# EAGLE design uNav44_r1 (EAGLE 6.5.0)
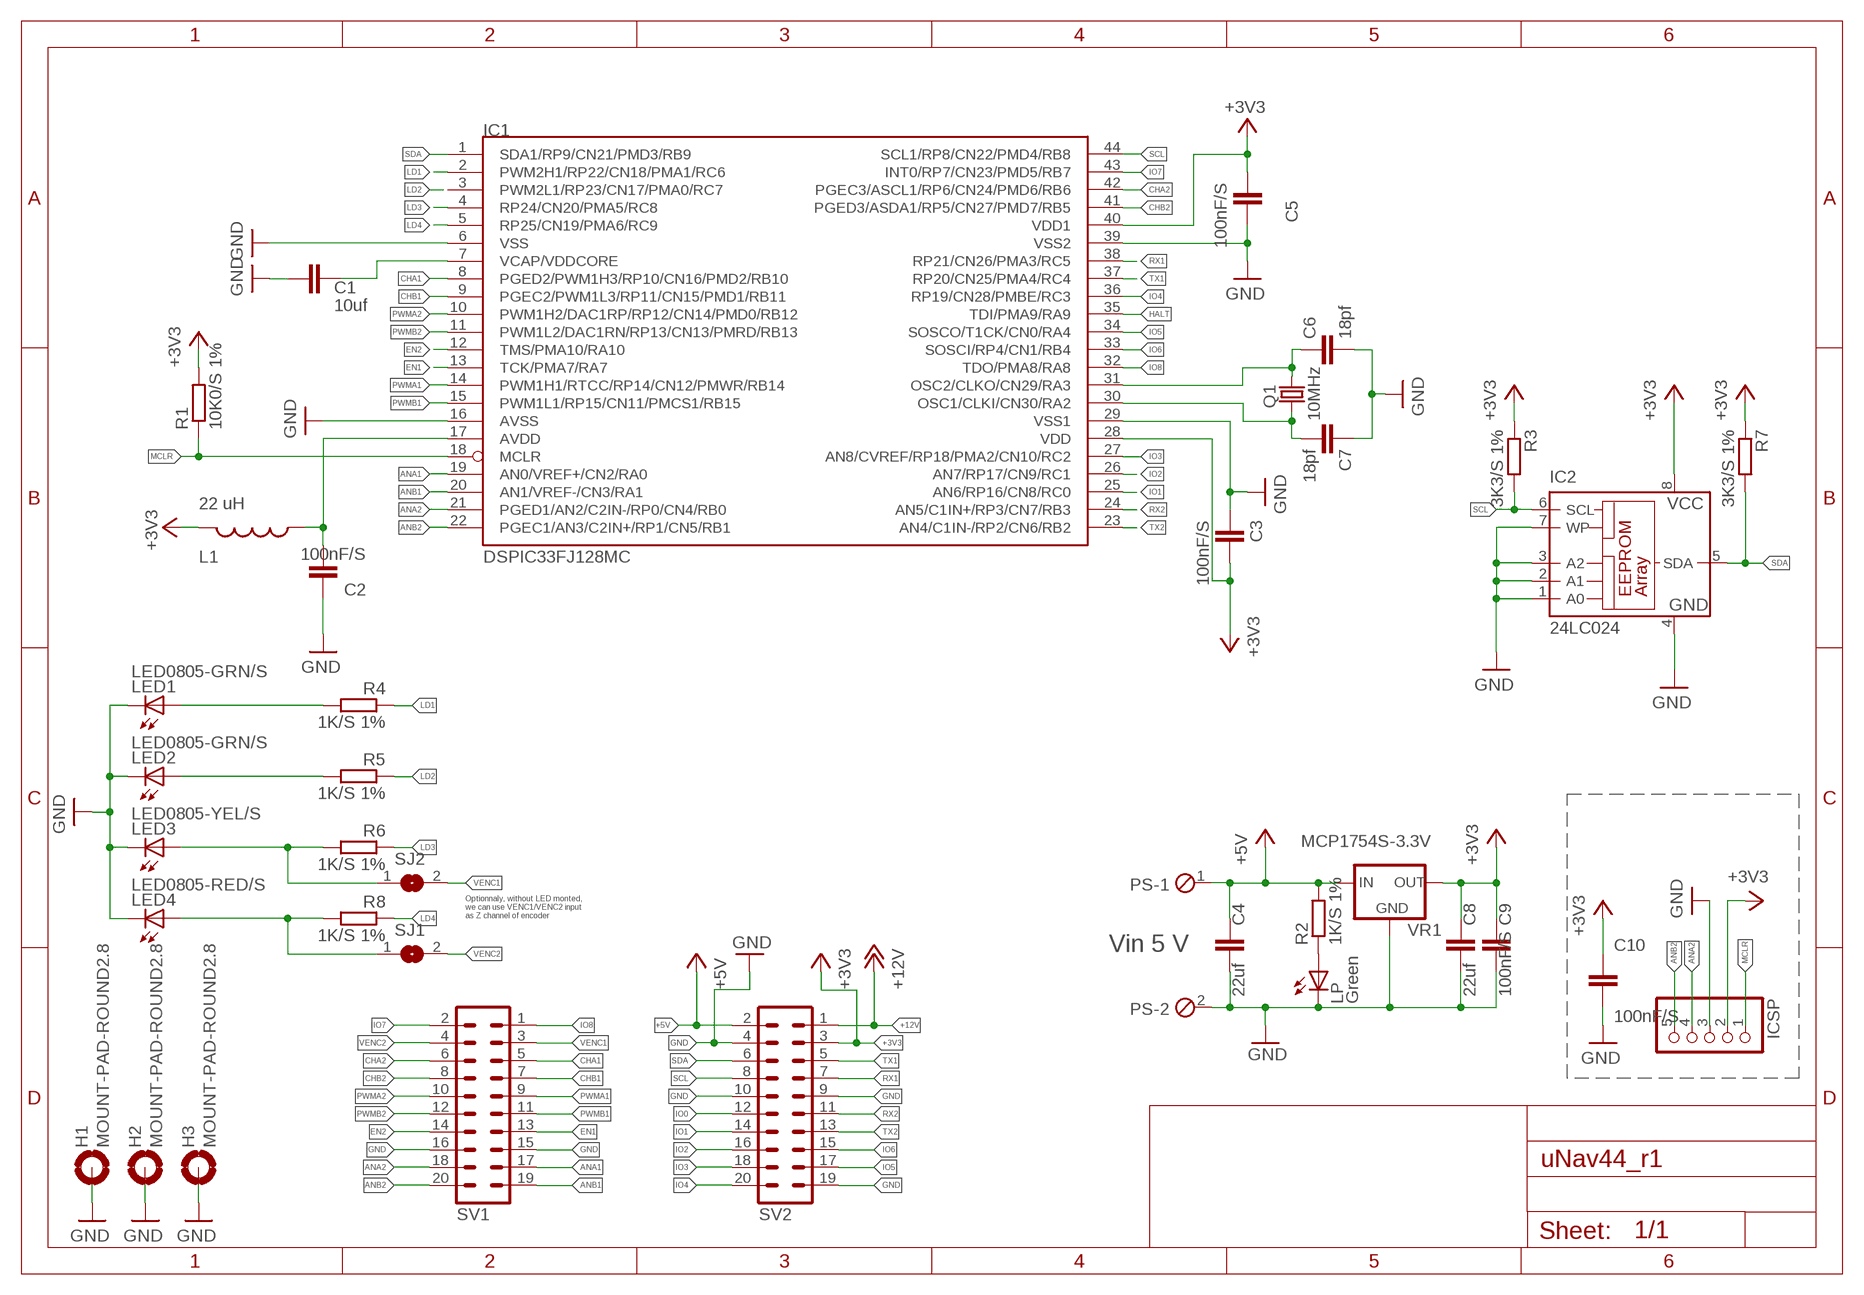
[diagram p0: schematic, sheet 1]

## Parts
C1  10uf  C-EUC1206  [C1206]
C2  100nF/S  C-EUC0603  [C0603]
C3  100nF/S  C-EUC0603  [C0603]
C4  22uf  C-EUC1206  [C1206]
C5  100nF/S  C-EUC0603  [C0603]
C6  18pf  C-EUC0603  [C0603]
C7  18pf  C-EUC0603  [C0603]
C8  22uf  C-EUC1206  [C1206]
C9  100nF/S  C-EUC0603  [C0603]
C10  100nF/S  C-EUC0603  [C0603]
H1  MOUNT-PAD-ROUND2.8  [2,8-PAD]
H2  MOUNT-PAD-ROUND2.8  [2,8-PAD]
H3  MOUNT-PAD-ROUND2.8  [2,8-PAD]
IC1  DSPIC33FJ128MC  DSPIC33FJ128MC804-PT  [TQFP44]
IC2  24LC024  24AA01SM  [SO-08M]
ICSP  PINHD-1X05_2.54-S  [1X05-S]
L1  22 uH  INDUCTOR0805  [0805]
LED1  LED0805-GRN/S  LEDCHIPLED_0805  [CHIPLED_0805]
LED2  LED0805-GRN/S  LEDCHIPLED_0805  [CHIPLED_0805]
LED3  LED0805-YEL/S  LEDCHIPLED_0805  [CHIPLED_0805]
LED4  LED0805-RED/S  LEDCHIPLED_0805  [CHIPLED_0805]
LP  Green  LEDCHIPLED_0805  [CHIPLED_0805]
PS  MPT2  [2POL254]
Q1  10MHz  CRYSTALHC49U-V  [HC49U-V]
R1  10K0/S 1%  R-EU_R0603  [R0603]
R2  1K/S 1%  R-EU_R0603  [R0603]
R3  3K3/S 1%  R-EU_R0603  [R0603]
R4  1K/S 1%  R-EU_R0603  [R0603]
R5  1K/S 1%  R-EU_R0603  [R0603]
R6  1K/S 1%  R-EU_R0603  [R0603]
R7  3K3/S 1%  R-EU_R0603  [R0603]
R8  1K/S 1%  R-EU_R0603  [R0603]
SJ1  SJ  [SJ]
SJ2  SJ  [SJ]
SV1  MA10-2  [MA10-2]
SV2  MA10-2  [MA10-2]
VR1  MCP1754S-3.3V  MCP1754S  [SOT89]

## Nets
+3V3: C3.1 C5.2 C8.1 C9.1 C10.1 IC1.28(VDD) IC1.40(VDD1) IC2.8(VCC) ICSP.2 L1.2 R1.2 R3.1 R7.1 SV2.3 VR1.3(OUT)
+5V: C4.1 PS.1 R2.2 SV2.2 VR1.1(IN)
+12V: SV2.1
ANA1: IC1.19(AN0/VREF+/CN2/RA0) SV1.17
ANA2: IC1.21(PGED1/AN2/C2IN-/RP0/CN4/RB0) ICSP.4 SV1.18
ANB1: IC1.20(AN1/VREF-/CN3/RA1) SV1.19
ANB2: IC1.22(PGEC1/AN3/C2IN+/RP1/CN5/RB1) ICSP.5 SV1.20
AVDD: C2.2 IC1.17(AVDD) L1.1
CHA1: IC1.8(PGED2/PWM1H3/RP10/CN16/PMD2/RB10) SV1.5
CHA2: IC1.42(PGEC3/ASCL1/RP6/CN24/PMD6/RB6) SV1.6
CHB1: IC1.9(PGEC2/PWM1L3/RP11/CN15/PMD1/RB11) SV1.7
CHB2: IC1.41(PGED3/ASDA1/RP5/CN27/PMD7/RB5) SV1.8
EN1: IC1.13(TCK/PMA7/RA7) SV1.13
EN2: IC1.12(TMS/PMA10/RA10) SV1.14
GND: C1.2 C2.1 C3.2 C4.2 C5.1 C6.2 C7.1 C8.2 C9.2 C10.2 H1.B2,8(MOUNT) H2.B2,8(MOUNT) H3.B2,8(MOUNT) IC1.6(VSS) IC1.16(AVSS) IC1.29(VSS1) IC1.39(VSS2) IC2.1(A0) IC2.2(A1) IC2.3(A2) IC2.4(GND) IC2.7(WP) ICSP.3 LED1.C LED2.C LED3.C LED4.C LP.C PS.2 SV1.15 SV1.16 SV2.4 SV2.9 SV2.10 SV2.19 VR1.2(GND) VR1.4(GND)
HALT: IC1.35(TDI/PMA9/RA9)
IO0: SV2.12
IO1: IC1.25(AN6/RP16/CN8/RC0) SV2.14
IO2: IC1.26(AN7/RP17/CN9/RC1) SV2.16
IO3: IC1.27(AN8/CVREF/RP18/PMA2/CN10/RC2) SV2.18
IO4: IC1.36(RP19/CN28/PMBE/RC3) SV2.20
IO5: IC1.34(SOSCO/T1CK/CN0/RA4) SV2.17
IO6: IC1.33(SOSCI/RP4/CN1/RB4) SV2.15
IO7: IC1.43(INT0/RP7/CN23/PMD5/RB7) SV1.2
IO8: IC1.32(TDO/PMA8/RA8) SV1.1
LD1: IC1.2(PWM2H1/RP22/CN18/PMA1/RC6) R4.1
LD2: IC1.3(PWM2L1/RP23/CN17/PMA0/RC7) R5.1
LD3: IC1.4(RP24/CN20/PMA5/RC8) R6.1
LD4: IC1.5(RP25/CN19/PMA6/RC9) R8.1
MCLR: IC1.18(MCLR) ICSP.1 R1.1
N$2: C7.2 IC1.30(OSC1/CLKI/CN30/RA2) Q1.1
N$3: C6.1 IC1.31(OSC2/CLKO/CN29/RA3) Q1.2
N$5: LP.A R2.1
N$12: LED1.A R4.2
N$13: LED2.A R5.2
PWMA1: IC1.14(PWM1H1/RTCC/RP14/CN12/PMWR/RB14) SV1.9
PWMA2: IC1.10(PWM1H2/DAC1RP/RP12/CN14/PMD0/RB12) SV1.10
PWMB1: IC1.15(PWM1L1/RP15/CN11/PMCS1/RB15) SV1.11
PWMB2: IC1.11(PWM1L2/DAC1RN/RP13/CN13/PMRD/RB13) SV1.12
RX1: IC1.38(RP21/CN26/PMA3/RC5) SV2.7
RX2: IC1.24(AN5/C1IN+/RP3/CN7/RB3) SV2.11
SCL: IC1.44(SCL1/RP8/CN22/PMD4/RB8) IC2.6(SCL) R3.2 SV2.8
SDA: IC1.1(SDA1/RP9/CN21/PMD3/RB9) IC2.5(SDA) R7.2 SV2.6
TX1: IC1.37(RP20/CN25/PMA4/RC4) SV2.5
TX2: IC1.23(AN4/C1IN-/RP2/CN6/RB2) SV2.13
VCAP/VDDCORE: C1.1 IC1.7(VCAP/VDDCORE)
VENC1: SJ2.2 SV1.3
VENC1-LD3: LED3.A R6.2 SJ2.1
VENC2: SJ1.2 SV1.4
VENC2-LD4: LED4.A R8.2 SJ1.1

## Notes on the sheet
- Optionnaly, without LED monted, 
  we can use VENC1/VENC2 input
  as Z channel of encoder
- Vin 5 V

## Library data of the parts
C1-C10 = rcl:C-EU: CAPACITOR, European symbol
H1-H3 = holes:MOUNT-PAD-ROUND: MOUNTING PAD, round
IC1 = microchip-dspic33fjxxmc:DSPIC33FJ128MC804: dsPIC33FJ32MC302/304, dsPIC33FJ64MCX02/X04, AND dsPIC33FJ128MCX02/X04 High-Performance, 16-bit Digital Signal Controllers Package:44 Pin TQFP Operating Range: * Up to 40 MIPS operation (at 3.0V -3.6V): - Industrial temperature range (-40°C to +85°C) - Extended temperature range (-40°C to +125°C) High-Performance DSC CPU: * Modified Harvard architecture * C compiler optimized instruction set * 16-bit wide data path * 24-bit wide instructions * Linear program memory addressing up to 4M instruction words * Linear data memory addressing up to 64 Kbytes * 83 base instructions: mostly 1 word/1 cycle * Two 40-bit accumulators with rounding and saturation options * Flexible and powerful addressing modes: - Indirect - Modulo - Bit-Reversed * Software stack * 16 x 16 fractional/integer multiply operations * 32/16 and 16/16 divide operations * Single-cycle multiply and accumulate: - Accumulator write back for DSP operations - Dual data fetch * Up to ±16-bit shifts for up to 40-bit data Direct Memory Access (DMA): * 8-channel hardware DMA * Up to 2 Kbytes dual ported DMA buffer area (DMA RAM) to store data transferred via DMA: - Allows data transfer between RAM and a peripheral while CPU is executing code (no cycle stealing) * Most peripherals support DMA Timers/Capture/Compare/PWM: * Timer/Counters, up to five 16-bit timers: - Can pair up to make two 32-bit timers - One timer runs as a Real-Time Clock with an external 32.768 kHz oscillator - Programmable prescaler * Input Capture (up to four channels): - Capture on up, down or both edges - 16-bit capture input functions - 4-deep FIFO on each capture * Output Compare (up to four channels): - Single or Dual 16-bit Compare mode - 16-bit Glitchless PWM mode * Hardware Real-Time Clock/Calendar (RTCC): - Provides clock, calendar, and alarm functions Interrupt Controller: * 5-cycle latency * Up to 53 available interrupt sources * Up to three external interrupts * Seven programmable priority levels * Five processor exceptions Digital I/O: * Peripheral pin Select functionality * Up to 35 programmable digital I/O pins * Wake-up/Interrupt-on-Change for up to 31 pins * Output pins can drive from 3.0V to 3.6V * Up to 5V output with open drain configuration * All digital input pins are 5V tolerant * 4 mA sink on all I/O pins On-Chip Flash and SRAM: * Flash program memory (up to 128 Kbytes) * Data SRAM (up to 16 Kbytes) * Boot, Secure, and General Security for program Flash System Management: * Flexible clock options: - External, crystal, resonator, internal RC - Fully integrated Phase-Locked Loop (PLL) - Extremely low jitter PLL * Power-up Timer * Oscillator Start-up Timer/Stabilizer * Watchdog Timer with its own RC oscillator * Fail-Safe Clock Monitor * Reset by multiple sources Power Management: * On-chip 2.5V voltage regulator * Switch between clock sources in real time * Idle, Sleep, and Doze modes with fast wake-up Analog-to-Digital Converters (ADCs): * 10-bit, 1.1 Msps or 12-bit, 500 Ksps conversion: - Two and four simultaneous samples (10-bit ADC) - Up to nine input channels with auto-scanning - Conversion start can be manual or synchronized with one of four trigger sources - Conversion possible in Sleep mode - ±2 LSb max integral nonlinearity - ±1 LSb max differential nonlinearity Audio Digital-to-Analog Converter (DAC): - 16-bit Dual Channel DAC module - 100 Ksps maximum sampling rate - Second-Order Digital Delta-Sigma Modulator Comparator Module: * Two analog comparators with programmable input/output configuration CMOS Flash Technology: * Low-power, high-speed Flash technology * Fully static design * 3.3V (±10%) operating voltage * Industrial and Extended temperature * Low power consumption Motor Control Peripherals: * 6-channel 16-bit Motor Control PWM: - Three duty cycle generators - Independent or Complementary mode - Programmable dead-time and output polarity - Edge-aligned or center-aligned - Manual output override control - One Fault input - Trigger for ADC conversions - PWM frequency for 16-bit resolution (@ 40 MIPS) = 1220 Hz for Edge-Aligned mode, 610 Hz for Center-Aligned mode - PWM frequency for 11-bit resolution (@ 40 MIPS) = 39.1 kHz for Edge-Aligned mode, 19.55 kHz for Center-Aligned mode * 2-channel 16-bit Motor Control PWM: - One duty cycle generator - Independent or Complementary mode - Programmable dead time and output polarity - Edge-aligned or center-aligned - Manual output override control - One Fault input - Trigger for ADC conversions - PWM frequency for 16-bit resolution (@ 40 MIPS) = 1220 Hz for Edge-Aligned mode, 610 Hz for Center-Aligned mode - PWM frequency for 11-bit resolution (@ 40 MIPS) = 39.1 kHz for Edge-Aligned mode, 19.55 kHz for Center-Aligned mode * 2-Quadrature Encoder Interface module: - Phase A, Phase B, and index pulse input - 16-bit up/down position counter - Count direction status - Position Measurement (x2 and x4) mode - Programmable digital noise filters on inputs - Alternate 16-bit Timer/Counter mode - Interrupt on position counter rollover/underflow
IC2 = microchip:24*: Serial EEPROM I2C; MF: MICROCHIP; MPN: 24AA01-I/SN; OC_FARNELL: 1331268; OC_NEWARK: 92C6793
ICSP = pinhead-2:PINHD-1X05: PIN HEADER
L1 = SparkFun-Passives:INDUCTOR: Inductors Basic Inductor/Choke - 0603 and 1206. Footprints are not proven and vary greatly between part numbers. SRN6045- 33uH, 20% 1.4A SDR0403-560KL - 56uH, 10%, 500mA RMS/740mA peak
LED1-LED4 LP = led:LED: LED OSRAM: - CHIPLED LG R971, LG N971, LY N971, LG Q971, LY Q971, LO R971, LY R971 LH N974, LH R974 LS Q976, LO Q976, LY Q976 LO Q996 - Hyper CHIPLED LW Q18S LB Q993, LB Q99A, LB R99A - SideLED LS A670, LO A670, LY A670, LG A670, LP A670 LB A673, LV A673, LT A673, LW A673 LH A674 LY A675 LS A676, LA A676, LO A676, LY A676, LW A676 LS A679, LY A679, LG A679 - Hyper Micro SIDELED® LS Y876, LA Y876, LO Y876, LY Y876 LT Y87S - SmartLED LW L88C, LW L88S LB L89C, LB L89S, LG L890 LS L89K, LO L89K, LY L89K LS L896, LA L896, LO L896, LY L896 - TOPLED LS T670, LO T670, LY T670, LG T670, LP T670 LSG T670, LSP T670, LSY T670, LOP T670, LYG T670 LG T671, LOG T671, LSG T671 LB T673, LV T673, LT T673, LW T673 LH T674 LS T676, LA T676, LO T676, LY T676, LB T676, LH T676, LSB T676, LW T676 LB T67C, LV T67C, LT T67C, LS T67K, LO T67K, LY T67K, LW E67C LS E67B, LA E67B, LO E67B, LY E67B, LB E67C, LV E67C, LT E67C LW T67C LS T679, LY T679, LG T679 LS T770, LO T770, LY T770, LG T770, LP T770 LB T773, LV T773, LT T773, LW T773 LH T774 LS E675, LA E675, LY E675, LS T675 LS T776, LA T776, LO T776, LY T776, LB T776 LHGB T686 LT T68C, LB T68C - Hyper Mini TOPLED® LB M676 - Mini TOPLED Santana® LG M470 LS M47K, LO M47K, LY M47K Source: http://www.osram.convergy.de/
PS = Personale:MPT2: PHOENIX CONNECTOR
Q1 = crystal:CRYSTAL: CRYSTAL; OC_FARNELL: 1666969; OC_NEWARK: unknown
R1-R8 = rcl:R-EU_: RESISTOR, European symbol
SJ1 SJ2 = jumper:SJ: SMD solder JUMPER
SV1 SV2 = con-lstb:MA10-2: PIN HEADER; OC_FARNELL: unknown; OC_NEWARK: unknown
VR1 = Personale:MCP1754S

## Net classes
0 default: width 0.254 mm, drill 0.406 mm, clearance 0.178 mm
1 power: width 0.305 mm, drill 0.406 mm, clearance 0.203 mm

## Board
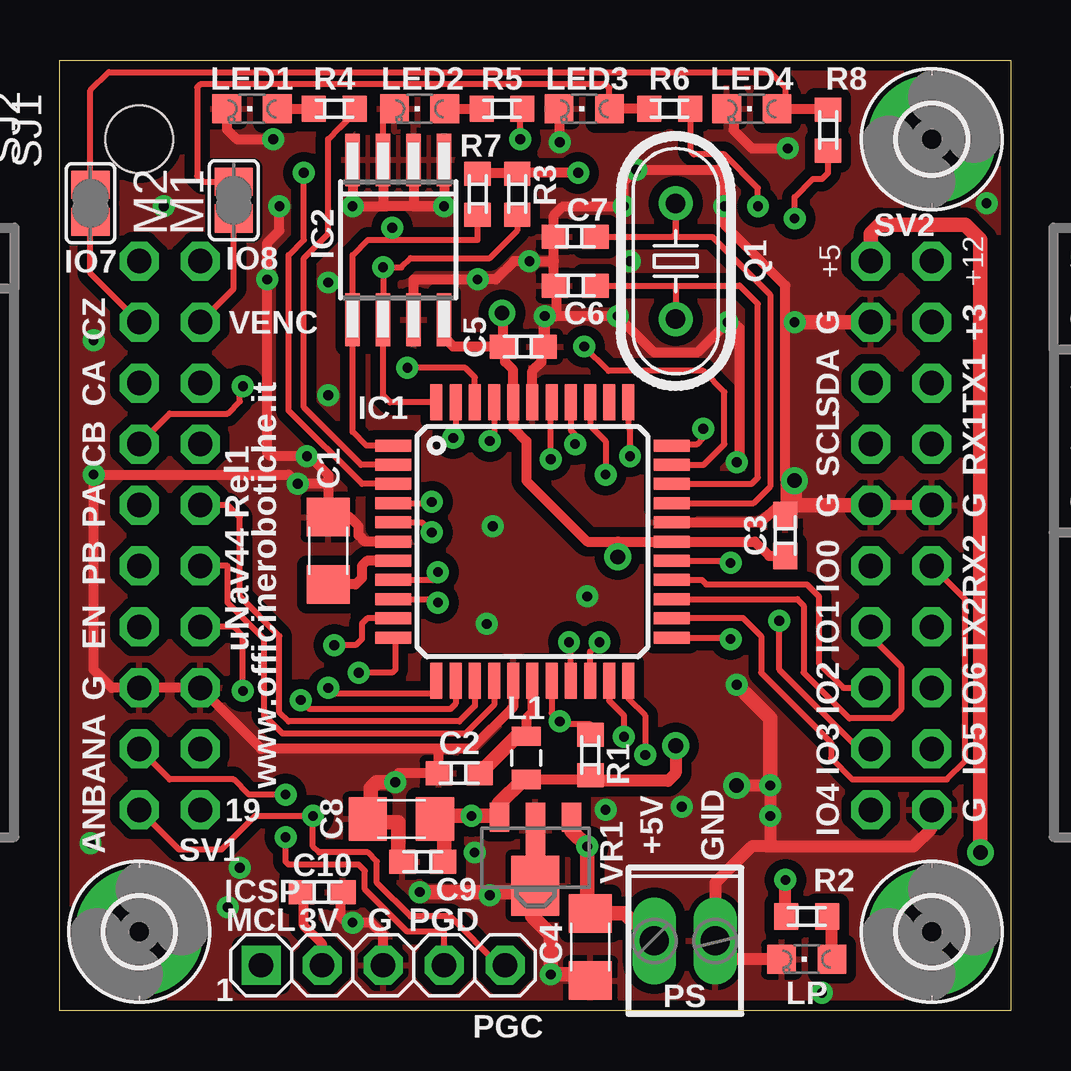
[diagram p1: board, top side]
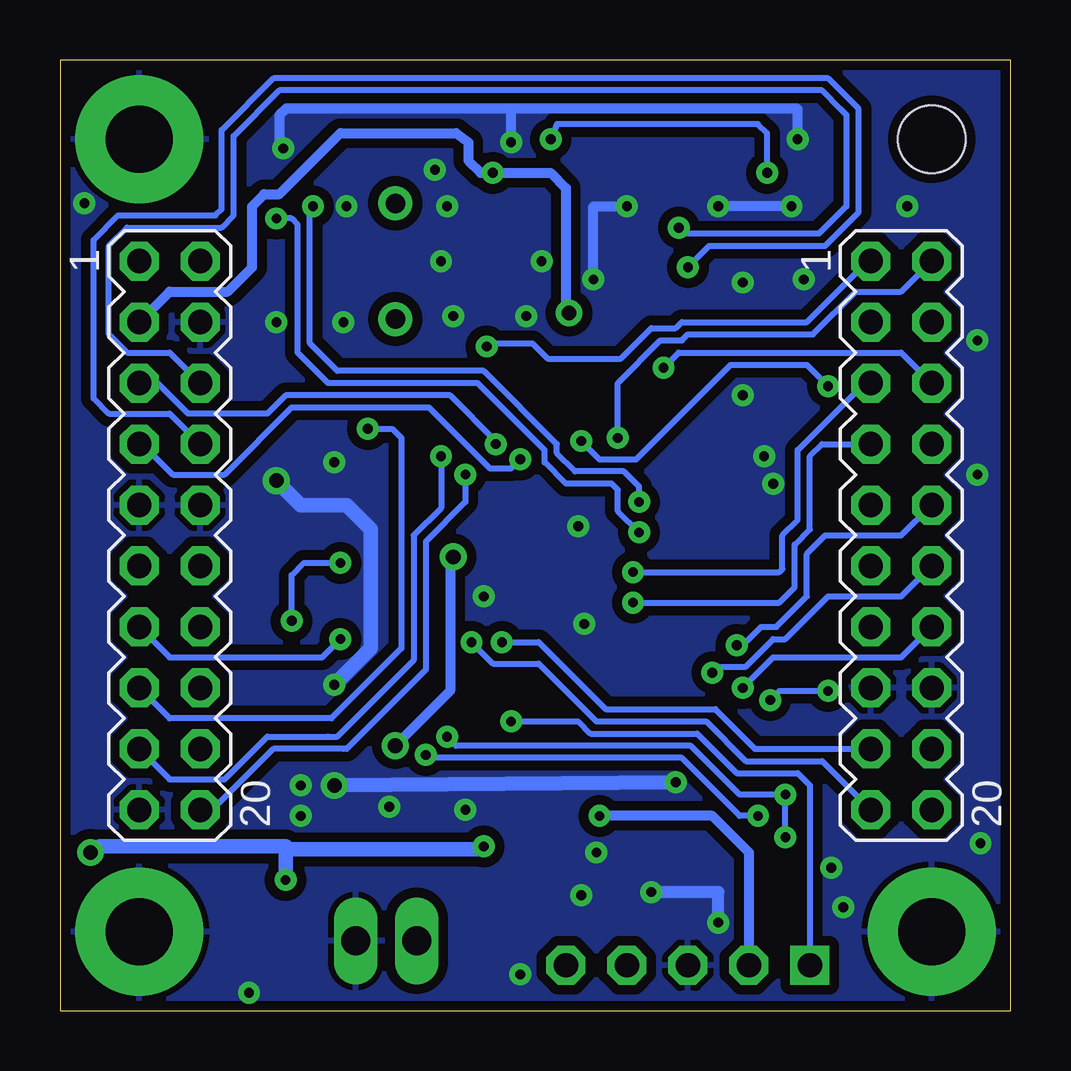
[diagram p2: board, bottom side, seen from below]

Size 39.62 x 39.62 mm. Coordinates in mm from the lower left corner, seen from the top.
Outline: 39.62,0 0,0 0,39.62 39.62,39.62 39.62,0
Copper layers (1*16): Top 0.035mm / dielectric 1.5mm / Bottom 0.035mm
Design rules: minimum track width 8mil, minimum drill 12mil, track to track 8mil, track to pad 8mil, pad to pad 8mil, via to via 8mil, smd to smd 8mil, copper to edge 10mil, drill to drill 8mil, minimum pad ring 12mil, minimum via ring 10mil, stop-mask expansion 4mil, vias tented up to drill 20mil, thermal gap 10mil
Holes 2.8 mm at 3.3,36.32

### Footprints (pad centres in the part's own frame; a part is rotated, then mirrored left to right if it is on the bottom)
C1206 = smd 1.6 x 1.8: 1 -1.4,0; 2 1.4,0
C0603 = smd 1.1 x 1: 1 -0.85,0; 2 0.85,0
2,8-PAD = drill 2.8 pad 5.334: B2,8 0,0
TQFP44 = smd 1.5 x 0.5: 1 -5.8,4; 2 -5.8,3.2; 3 -5.8,2.4; 4 -5.8,1.6; 5 -5.8,0.8; 6 -5.8,0; 7 -5.8,-0.8; 8 -5.8,-1.6; 9 -5.8,-2.4; 10 -5.8,-3.2; 11 -5.8,-4; 23 5.8,-4; 24 5.8,-3.2; 25 5.8,-2.4; 26 5.8,-1.6; 27 5.8,-0.8; 28 5.8,0; 29 5.8,0.8; 30 5.8,1.6; 31 5.8,2.4; 32 5.8,3.2; 33 5.8,4 | smd 0.5 x 1.5: 12 -4,-5.8; 13 -3.2,-5.8; 14 -2.4,-5.8; 15 -1.6,-5.8; 16 -0.8,-5.8; 17 0,-5.8; 18 0.8,-5.8; 19 1.6,-5.8; 20 2.4,-5.8; 21 3.2,-5.8; 22 4,-5.8; 34 4,5.8; 35 3.2,5.8; 36 2.4,5.8; 37 1.6,5.8; 38 0.8,5.8; 39 0,5.8; 40 -0.8,5.8; 41 -1.6,5.8; 42 -2.4,5.8; 43 -3.2,5.8; 44 -4,5.8
SO-08M = smd 0.6 x 2.2: 1 -1.905,-3.33; 2 -0.635,-3.33; 3 0.635,-3.33; 4 1.905,-3.33; 5 1.905,3.33; 6 0.635,3.33; 7 -0.635,3.33; 8 -1.905,3.33
1X05-S = drill 1.016 square: 1 -5.08,0 | drill 1.016 octagon: 2 -2.54,0; 3 0,0; 4 2.54,0; 5 5.08,0
0805 = smd 0.8 x 1.2: 1 -0.9,0; 2 0.9,0
CHIPLED_0805 = smd 1.2 x 1.2: A 0,-1.05; C 0,1.05
2POL254 = drill 1.2 long: 1 -1.27,0; 2 1.27,0
HC49U-V = drill 0.813: 1 -2.413,0; 2 2.413,0
R0603 = smd 1 x 1.1: 1 -0.85,0; 2 0.85,0
SJ = smd 1.168 x 1.6: 1 -0.762,0; 2 0.762,0
MA10-2 = drill 1.016 octagon: 1 -11.43,-1.27; 2 -11.43,1.27; 3 -8.89,-1.27; 4 -8.89,1.27; 5 -6.35,-1.27; 6 -6.35,1.27; 7 -3.81,-1.27; 8 -3.81,1.27; 9 -1.27,-1.27; 10 -1.27,1.27; 11 1.27,-1.27; 12 1.27,1.27; 13 3.81,-1.27; 14 3.81,1.27; 15 6.35,-1.27; 16 6.35,1.27; 17 8.89,-1.27; 18 8.89,1.27; 19 11.43,-1.27; 20 11.43,1.27
SOT89 = smd 0.8 x 1.2: 1 -1.5,-1.6; 3 1.5,-1.6 | smd 0.8 x 2.3: 2 0,-1.05 | smd 2 x 2.5: 4 0,1.25

### Placement (x,y rotation side)
C1  11.18,19.18 90 top
C2  16.64,9.91 0 top
C3  30.23,19.81 90 top
C4  22.1,2.67 270 top
C5  19.3,27.69 180 top
C6  21.46,30.23 180 top
C7  21.46,32.26 0 top
C8  14.22,8 180 top
C9  15.11,6.22 180 top
C10  10.92,4.95 0 top
H1  3.3,3.3 0 top
H2  36.32,3.3 0 top
H3  36.32,36.32 0 top
IC1  19.68,19.56 0 top
IC2  14.1,32.13 180 top
ICSP  13.46,1.91 0 top
L1  19.43,10.54 270 top
LED1  8,37.59 90 top
LED2  14.99,37.59 90 top
LED3  21.84,37.59 90 top
LED4  28.83,37.59 90 top
LP  31.11,2.16 90 top
PS  26.04,2.92 0 top
Q1  25.65,31.24 270 top
R1  22.1,10.67 270 top
R2  31.11,3.94 180 top
R3  19.05,34.04 270 top
R4  11.43,37.59 180 top
R5  18.41,37.59 180 top
R6  25.4,37.59 180 top
R7  17.4,34.04 270 top
R8  32,36.7 90 top
SJ1  1.27,33.66 270 top
SJ2  7.24,33.78 270 top
SV1  4.57,19.81 270 bottom
SV2  35.05,19.81 270 bottom
VR1  19.81,6.48 180 top

### Tracks (layer width: path | path; a pad name or v marks a point on that pad's centre or on a via)
+3V3  (via drill 0.41, 0.61)
  Top 0.254: R7.1 17.44,34.93
  Top 0.406: C5.2 18.54,27.6 18.54,27.05 18.89,26.71 IC1.40 18.89,24.29 19.43,23.75 19.43,22.1 21.97,19.56 23.24,19.56 | C5.2 16.38,27.69 16,28.07 IC2.8 | R7.1 17.4,34.93 19.05,34.93 | 19.05,34.93 R3.1 | ICSP.2 10.92,2.79 10.16,3.56 10.16,4.83 10.03,4.95 C10.1 | 23.24,19.56 IC1.28 28.96,19.56 29.55,18.96 C3.1 | v21.59,34.93 19.05,34.93 | v18.41,29.08 18.45,29 C5.2 | 23.24,19.56 v23.24,18.92 | L1.2 21.59,9.65 | 21.59,9.65 21.72,9.59 21.67,9.64 R1.2 | L1.2 21.59,9.65 | 21.59,9.65 22.1,9.65 22.16,9.59 | VR1.3 18.31,8.27 | 19.29,9.64 L1.2
  Top 0.508: v25.65,11.05 25.65,9.91 25.34,9.59 22.16,9.59
  Top 0.61: C9.1 16,6.22 | 16.13,6.22 16,6.22 | 16,6.22 16,8.13 | 18.29,8.13 VR1.3 18.29,8.1 18.29,8.13 | 18.29,8.13 v17.14,8.13 16,8.13 | C8.1 15.75,8.13 16,8.13 | 19.29,9.64 18.29,8.64 18.29,8.13
  Bottom 0.406: v17.14,8.13 12.45,8.13 10.92,6.6 ICSP.2 | v18.41,29.08 18.54,29.21 18.54,34.29 19.18,34.93 v21.59,34.93 22.1,34.93 22.61,35.43 22.61,36.2 23.11,36.58 27.94,36.58 30.48,34.04 31.11,34.04 31.62,33.53 31.62,30.99 32.64,29.97 35.05,29.97 SV2.3 | v23.24,18.92 23.37,18.92 23.37,13.33 v25.65,11.05
+5V  (via drill 0.41, 0.61)
  Top 0.406: v21.97,6.86 21.97,3.94 C4.1
  Top 0.508: R2.2 30.23,3.94 v30.23,5.46 | 21.97,4.32 C4.1
  Top 0.61: SV2.2 33.78,32.38 34.16,32.77 37.72,32.77 38.35,32.13 v38.35,6.6 | VR1.1 21.31,7.52 v21.97,6.86 21.97,4.32 | C4.1 23.49,4.07 PS.1
  Bottom 0.406: 22.1,6.73 v21.97,6.86
  Bottom 0.61: v30.23,5.46 30.23,6.73 | 30.23,6.73 22.1,6.73 | v38.35,6.6 37.97,6.86 30.23,6.86 30.23,6.73
ANA1  (via drill 0.41)
  Top 0.254: IC1.19 21.29,15.29 v21.21,15.37
  Bottom 0.254: v21.21,15.37 19.68,15.37 16.89,12.57 12.32,12.57 10.67,10.92 SV1.17
ANA2  (via drill 0.41)
  Top 0.254: IC1.21 22.88,12.93 23.5,12.32 v23.5,11.43 | ICSP.4 16,3.3 14.48,3.3 12.7,5.08 12.7,5.84 12.45,6.1 9.53,6.1 9.4,6.22 v9.4,7.24 | v9.4,9.02 7.87,9.02 7.24,9.65 4.57,9.65 SV1.18
  Bottom 0.254: v23.5,11.43 23.11,11.05 13.33,11.05 11.3,9.02 v9.4,9.02 v9.4,7.24
ANB1  (via drill 0.41)
  Top 0.254: IC1.20 22.09,14.97 v22.48,15.37
  Bottom 0.254: v22.48,15.37 21.59,14.48 19.68,14.48 17.27,12.06 12.7,12.06 11.05,10.41 7.87,10.41 SV1.19
ANB2  (via drill 0.41)
  Top 0.254: IC1.22 23.68,13.02 24.38,12.32 v24.38,10.67 | 18.54,1.78 ICSP.5 18.29,1.91 16.26,3.94 14.61,3.94 13.21,5.33 13.21,6.22 12.83,6.6 10.79,6.6 10.54,6.86 v10.54,8.13 8.13,8.13 6.73,6.73 4.95,6.73 SV1.20
  Bottom 0.254: v24.38,10.67 24.26,10.54 13.72,10.54 11.3,8.13 v10.54,8.13
AVDD
  Top 0.406: IC1.17 19.68,12.45 19.43,12.19 L1.1
  Top 0.61: L1.1 19.02,11.44 C2.2
CHA1  (via drill 0.41)
  Top 0.254: IC1.8 15.8,17.96 v15.75,18.29
  Bottom 0.254: v15.75,18.29 9.65,18.29 9.53,18.41 9.53,19.81 8.89,20.45 8.89,23.37 6.1,26.16 SV1.5
CHA2  (via drill 0.41)
  Top 0.254: IC1.42 17.29,26.4 16.89,26.8 v14.48,26.8
  Bottom 0.254: SV1.6 4.57,27.43 13.84,27.43 v14.48,26.8
CHB1  (via drill 0.41)
  Top 0.254: IC1.9 15.61,17.16 v15.75,17.02
  Bottom 0.254: SV1.7 7.87,23.62 8.38,23.11 8.38,20.07 9.02,19.43 9.02,17.65 9.65,17.02 v15.75,17.02
CHB2  (via drill 0.41)
  Top 0.254: IC1.41 18.09,23.95 v17.91,23.75 | SV1.8 4.57,24.89 6.98,24.89 7.49,25.4 7.49,25.91 v7.62,26.04
  Bottom 0.254: v17.91,23.75 17.14,22.99 15.62,22.99 11.68,26.92 8.51,26.92 v7.62,26.04
EN1  (via drill 0.41)
  Top 0.254: IC1.13 16.48,12.8 16.26,12.57 10.41,12.57 v10.03,12.95 | v7.62,13.33 7.62,15.62 7.24,16 SV1.13
  Bottom 0.254: v10.03,12.95 9.65,13.33 v7.62,13.33
EN2  (via drill 0.41)
  Top 0.254: IC1.12 15.68,13.4 15.49,13.21 11.43,13.21 v11.18,13.46 11.26,13.38
  Bottom 0.254: v11.18,13.46 9.91,14.73 4.57,14.73 SV1.14
GND  (via drill 0.41, 0.61)
  Top 0.254: C7.1 20.57,32.26 | 20.57,30.61 C6.2 | IC2.3 13.46,37.69 LED2.C
  Top 0.406: v28.19,22.86 28.32,22.99 28.32,28.45 28.07,28.7 v27.81,28.7 26.54,27.43 24.77,27.43 v23.24,28.96 20.7,28.96 | 20.7,28.96 20.7,30.48 20.57,30.61 20.57,31.24 | 20.57,31.24 20.57,32.26 20.57,33.15 20.95,33.53 v23.5,33.53 23.5,34.54 v24,35.05 27.43,35.05 27.69,34.8 v27.69,33.53 27.69,32.77 30.23,30.23 30.23,28.7 | IC2.3 13.46,33.66 | 13.46,33.66 13.46,33.53 | 13.46,33.53 13.59,33.53 | IC2.1 v16,33.53 | IC2.2 14.73,33.53 v16,33.53 | IC2.4 v12.19,33.53 13.46,33.53 | LED1.C 6.95,36.74 7.37,36.32 v8.89,36.32 | LED4.C 28.07,37.63 28.07,36.7 28.83,35.94 v30.32,35.94 30.35,35.94 | IC1.29 29.17,20.36 29.84,20.95 30.09,20.41 C3.2 30.23,22.1 | 20.57,31.24 v19.56,31.24 18.92,31.24 18.16,30.48 v17.4,30.48 14.73,30.48 IC2.7 | IC1.39 19.68,26.67 20.07,27.05 20.07,27.6 C5.1 | C5.1 20.15,28.92 20.7,28.96 | IC1.16 18.89,12.66 17.14,10.92 15.88,10.92 | v16,33.53 13.59,33.53 | 13.59,33.53 13.46,33.66 | v20.19,28.96 20.19,27.72 C5.1 | ICSP.3 13.46,3.17 12.95,3.68 v12.19,3.68 11.94,3.68 11.68,3.94 11.68,4.95 C10.2 | 15.88,10.92 8.38,10.92 SV1.15 | SV1.15 SV1.16 | v9.14,33.53 9.14,32.51 8.64,32 8.64,23.24 8.76,23.11 10.41,23.11 11.18,22.35 C1.2 12.06,20.57 12.45,20.19 12.45,19.81 12.7,19.56 IC1.6 | SV1.15 2.16,13.46 1.4,14.22 v1.4,22.35 9.53,22.35 v9.91,21.97 11.18,21.97 C1.2 | SV2.9 SV2.10 | v30.61,22.1 30.23,22.1 | v30.61,28.7 30.23,28.7 | 30.23,22.1 30.23,28.7 | VR1.2 VR1.4 19.81,4.7 19.94,4.57 | v14.99,4.95 19.81,4.95 19.83,4.93 19.83,4.57 | 15.88,10.92 15.79,10.83 C2.1 14.1,9.91 14.06,9.87 14.06,9.82 14.01,9.56 v13.97,9.53 | LED3.C 20.79,36.48 v20.83,36.2
  Top 0.508: 29.46,6.86 35.56,6.86 36.32,7.62 SV2.19 | 19.68,5.1 VR1.4 | LP.C 27.56,2.16 27.3,2.41 PS.2 27.3,5.33 28.83,6.86 29.46,6.86 | v28.19,9.4 v29.59,9.4 29.59,6.98 29.46,6.86 | 22.1,1.52 22.1,1.4 C4.2
  Top 0.61: 19.83,4.57 VR1.4 | 22.1,1.52 v20.45,1.52 20.45,3.17 19.68,3.94 19.68,5.1 | 19.94,4.57 19.94,4.7 19.68,4.95 v14.99,4.95 | v30.61,22.1 30.61,21.08 SV2.10 | v30.61,28.7 SV2.4 | v28.19,13.59 29.59,12.19 v29.59,9.4 | 14.22,6.22 14.1,6.22 14.1,7.87 12.95,7.87 C8.2 | 12.95,8 12.95,9.27 13.21,9.53 v13.97,9.53
  Bottom 0.406: v17.4,30.48 17.4,33.53 v16,33.53 | v9.14,33.53 v12.19,33.53 | v8.89,36.32 8.89,37.59 20.7,37.59 | 20.7,37.59 30.23,37.59 30.48,37.34 30.48,35.72 v30.32,35.94 | v20.83,36.2 20.83,37.46 20.7,37.59
  Bottom 0.508: v12.19,3.68 12.19,4.95 v14.99,4.95
  Bottom 0.61: v13.97,9.53 v28.19,9.4 | v30.61,22.1 29.59,21.08 27.69,21.08 26.67,20.07 26.67,15.11 v28.19,13.59
  other vias: 21.97,17.27 17.78,16.13 18.03,20.19 7.49,5.97 38.61,33.66 1.4,27.94 8.64,30.48 23.75,31.24 1.27,6.98 6.98,4.32 10.29,23.11 11.18,30.35 17.27,6.6 17.91,4.83 22.73,8.38 25.91,8.51 29.59,8.13 31.75,0.76 11.18,25.65 4.32,33.53
  pour Top (isolate 0.406): 0,39.62 0,0 39.62,0 39.62,39.62
  pour Bottom (isolate 0.406): 0,39.62 0,0 39.62,0 39.62,39.62
IO1
  Top 0.254: SV2.14 33.78,15.62 35.05,14.35 35.05,12.57 34.67,12.19 32.89,12.19 30.99,14.1 30.99,16.89 30.72,17.16 IC1.25
IO2
  Top 0.254: IC1.26 26.75,17.96 26.92,17.78 31.11,17.78 31.19,17.7 31.62,17.27 31.62,14.48 32.64,13.46 SV2.16
IO3  (via drill 0.41)
  Top 0.254: SV2.18 33.27,10.92 29.97,14.22 v29.97,16.26 | IC1.27 27.85,18.76 v27.94,18.67
  Bottom 0.254: v29.97,16.26 29.97,18.16 29.46,18.67 v27.94,18.67
IO4  (via drill 0.41)
  Top 0.254: IC1.36 22.1,25.34 22.1,24.38 22.73,23.75 v22.73,22.35
  Bottom 0.254: v22.73,22.35 22.73,21.21 24.38,19.56 24.38,14.22 27.69,10.92 27.81,10.92 30.73,10.92 33.27,8.38 SV2.20
IO5  (via drill 0.41)
  Top 0.254: IC1.34 23.68,24.32 23.75,24.26 v23.75,23.11
  Bottom 0.254: v23.75,23.11 23.75,20.95 24.89,19.81 24.89,14.61 28.07,11.43 28.45,11.43 30.99,11.43 32.77,9.65 35.05,9.65 SV2.17
IO6  (via drill 0.41)
  Top 0.254: IC1.33 25.48,23.58 25.32,23.58 25.27,23.62 26.54,23.62 26.8,23.88 v26.8,24.26
  Bottom 0.254: v26.8,24.26 25.78,24.26 25.4,23.88 25.4,15.11 28.32,12.19 35.05,12.19 SV2.15
IO7  (via drill 0.41)
  Top 0.254: IC1.43 16.48,23.98 v16.38,23.88
  Bottom 0.254: SV1.2 4.57,29.97 6.48,29.97 8.26,28.19 13.46,28.19 13.72,27.94 14.61,27.94 16.38,26.16 v16.38,23.88
IO8  (via drill 0.41)
  Top 0.254: IC1.32 26.82,22.76 27.69,23.62 27.69,25.78 26.8,26.67 22.86,26.67 v21.84,27.69
  Bottom 0.254: v21.84,27.69 21.72,27.81 19.94,27.81 19.3,27.18 16.26,27.18 14.99,28.45 13.97,28.45 13.72,28.7 8.51,28.7 5.97,31.24 SV1.1
LD1
  Top 0.254: IC1.2 12.55,22.76 10.16,25.15 10.16,31.37 11.18,32.38 11.18,36.32 11.64,36.79 11.68,36.83 12.32,37.46 R4.1
LD2  (via drill 0.41)
  Top 0.254: IC1.3 12.59,21.96 9.53,25.02 9.53,31.5 10.16,32.13 v10.16,34.93 | v19.18,36.32 19.18,37.72 R5.1
  Bottom 0.254: v10.16,34.93 10.16,36.58 10.54,36.96 18.92,36.96 v19.18,36.32
LD3  (via drill 0.41)
  Top 0.254: IC1.4 15.44,21.16 v15.49,21.21 | v29.08,33.53 29.08,34.29 27.69,35.69 26.42,35.69 26.29,35.81 26.29,37.68 R6.1
  Bottom 0.254: v15.49,21.21 15.49,21.84 16.13,22.48 18.16,22.48 18.92,23.24 18.92,23.62 21.97,26.67 28.07,26.67 29.21,27.81 29.21,33.4 v29.08,33.53
LD4  (via drill 0.41)
  Top 0.254: IC1.5 15.07,20.36 v15.49,19.94 | v30.61,33.02 30.61,33.91 31.37,34.67 31.75,34.67 32,34.93 R8.1
  Bottom 0.254: v15.49,19.94 16.38,20.83 16.38,21.72 16.64,21.97 18.54,21.97 19.43,22.86 19.43,23.37 22.22,26.16 28.45,26.16 29.72,27.43 29.72,32.77 29.97,33.02 v30.61,33.02
MCLR  (via drill 0.41)
  Top 0.254: IC1.18 20.48,12.41 v20.83,12.06 20.95,12.06 21.08,11.94 22.1,11.94 R1.1
  Bottom 0.254: v20.83,12.06 18.03,12.06 17.53,11.56 13.08,11.56 11.43,9.91 8.89,9.91 8.38,9.4 ICSP.1
N$2
  Top 0.254: C7.2 25.53,32.26 25.65,32.38 Q1.1 25.65,32.26 27.18,32.26 29.59,29.84 29.59,21.84 28.91,21.16 IC1.30
N$3
  Top 0.254: C6.1 25.65,30.23 | 25.65,30.23 Q1.2 | 25.65,30.23 28.32,30.23 29.08,29.46 29.08,22.22 28.82,21.96 IC1.31
N$5
  Top 0.508: R2.1 32.13,3.94 32.13,2.16 LP.A
N$12
  Top 0.406: LED1.A R4.2
N$13
  Top 0.406: LED2.A R5.2
PWMA1
  Top 0.254: IC1.14 17.29,12.71 16.64,12.06 9.53,12.06 9.14,12.45 9.14,15.62 7.49,17.27 7.49,20.57 6.98,21.08 SV1.9
PWMA2  (via drill 0.41)
  Top 0.254: IC1.10 12.8,16.36 12.57,16.13 12.57,15.49 12.32,15.24 v11.43,15.24
  Bottom 0.254: v11.43,15.24 11.18,15.24 10.41,16 9.78,16 8.51,17.27 8.51,19.05 7.75,19.81 4.57,19.81 SV1.10
PWMB1
  Top 0.254: IC1.15 18.09,12.75 16.89,11.56 9.27,11.56 8.51,12.32 8.51,15.49 6.98,17.02 6.98,18.54 SV1.11
PWMB2  (via drill 0.41)
  Top 0.254: IC1.11 14.03,15.56 13.97,15.49 13.97,14.22 13.84,14.1 v12.45,14.1
  Bottom 0.254: v12.45,14.1 12.19,14.35 11.05,14.35 9.91,15.49 9.4,15.49 7.62,17.27 4.57,17.27 SV1.12
RX1  (via drill 0.41)
  Top 0.254: v20.45,22.99 20.45,25.32 IC1.38
  Bottom 0.254: v20.45,22.99 20.83,22.61 21.72,22.61 24.26,25.15 29.97,25.15 32.77,22.35 34.93,22.35 36.2,23.62 SV2.7
RX2
  Top 0.254: IC1.24 25.48,16.38 28.45,16.38 29.21,15.62 29.21,14.1 32.13,11.18 32.13,10.54 33.02,9.65 36.96,9.65 37.72,10.41 37.72,17.14 SV2.11
SCL  (via drill 0.41)
  Top 0.254: R3.2 19.05,32.51 17.91,31.37 14.61,31.37 14.22,30.99 v13.46,30.99 IC2.6 13.46,25.65 13.76,25.36 IC1.44
  Bottom 0.254: SV2.8 35.05,24.89 37.59,24.89 38.23,25.53 38.23,32.13 37.21,33.15 33.15,33.15 32.89,33.4 32.89,36.7 30.73,38.86 7.62,38.86 6.35,37.59 6.35,33.27 7.75,31.88 12.57,31.88 v13.46,30.99
SDA  (via drill 0.41)
  Top 0.254: 13.84,32.13 12.83,32.13 12.19,31.5 IC2.5 12.19,24.13 12.76,23.56 IC1.1 | 13.84,32.13 17.4,32.13 R7.2 | v13.84,32.64 13.84,32.13
  Bottom 0.254: SV2.6 35.05,27.43 36.83,27.43 37.59,28.19 37.59,31.88 36.83,32.64 32.89,32.64 32.38,33.15 32.38,36.45 30.48,38.35 7.87,38.35 7.11,37.59 6.86,37.34 6.86,33.53 8,32.38 13.59,32.38 v13.84,32.64
TX1  (via drill 0.41)
  Top 0.254: IC1.37 21.29,24.21 21.46,24 v21.46,23.62
  Bottom 0.254: v21.46,23.62 21.46,23.75 23.37,25.65 30.23,25.65 30.99,24.89 34.29,24.89 35.56,26.16 SV2.5
TX2  (via drill 0.41)
  Top 0.254: IC1.23 27.88,15.56 v27.94,15.49
  Bottom 0.254: SV2.13 35.05,14.73 28.7,14.73 v27.94,15.49
VCAP/VDDCORE
  Top 0.406: IC1.7 12.79,18.76 12.57,18.54 12.57,18.03 12.32,17.78 C1.1
VENC1
  Top 0.254: SV1.3 7.24,30.1 SJ2.2
VENC1-LD3
  Top 0.254: LED3.A 22.89,38.45 22.73,38.61 5.84,38.61 5.71,38.48 5.71,34.8 5.97,34.54 SJ2.1
  Top 0.406: R6.2 LED3.A
VENC2
  Top 0.254: SV1.4 1.27,30.73 SJ1.2
VENC2-LD4
  Top 0.254: SJ1.1 1.27,38.35 2.03,39.12 29.59,39.12 30.23,38.48 30.23,37.63 LED4.A
  Top 0.406: LED4.A 31.88,37.59 32,37.46 R8.2

### Text on the board
tPlace: M2 | M1 | BUS | M2 | M1 | IO7 | IO8 | IO7 | IO8 | +5 | +12 | 5V | 12V | VENC | CZ | GND | 3v | VENC | G | +3 | CHA | CA | SDA | TX1 | SDA | TX1 | CHB | CB | SCL | RX1 | SCL | RX1 | PWMA | PA | G | G | GND | GND | PWMB | PB | IO0 | RX2 | IO0 | RX2 | EN | EN | IO1 | TX2 | IO1 | TX2 | uNav44 Rel1 | GND | G | IO2 | IO6 | IO2 | IO6 | AN A | ANA | IO3 | IO5 | IO3 | IO5 | www.officinerobotiche.it | AN B | ANB | 19 | IO4 | G | IO4 | GND | +5V | GND | MCL | 3V | G | PGD | 1 | PGC